# EasyEDA Pro project 毕业设计PCB板.eprj, board PCB1
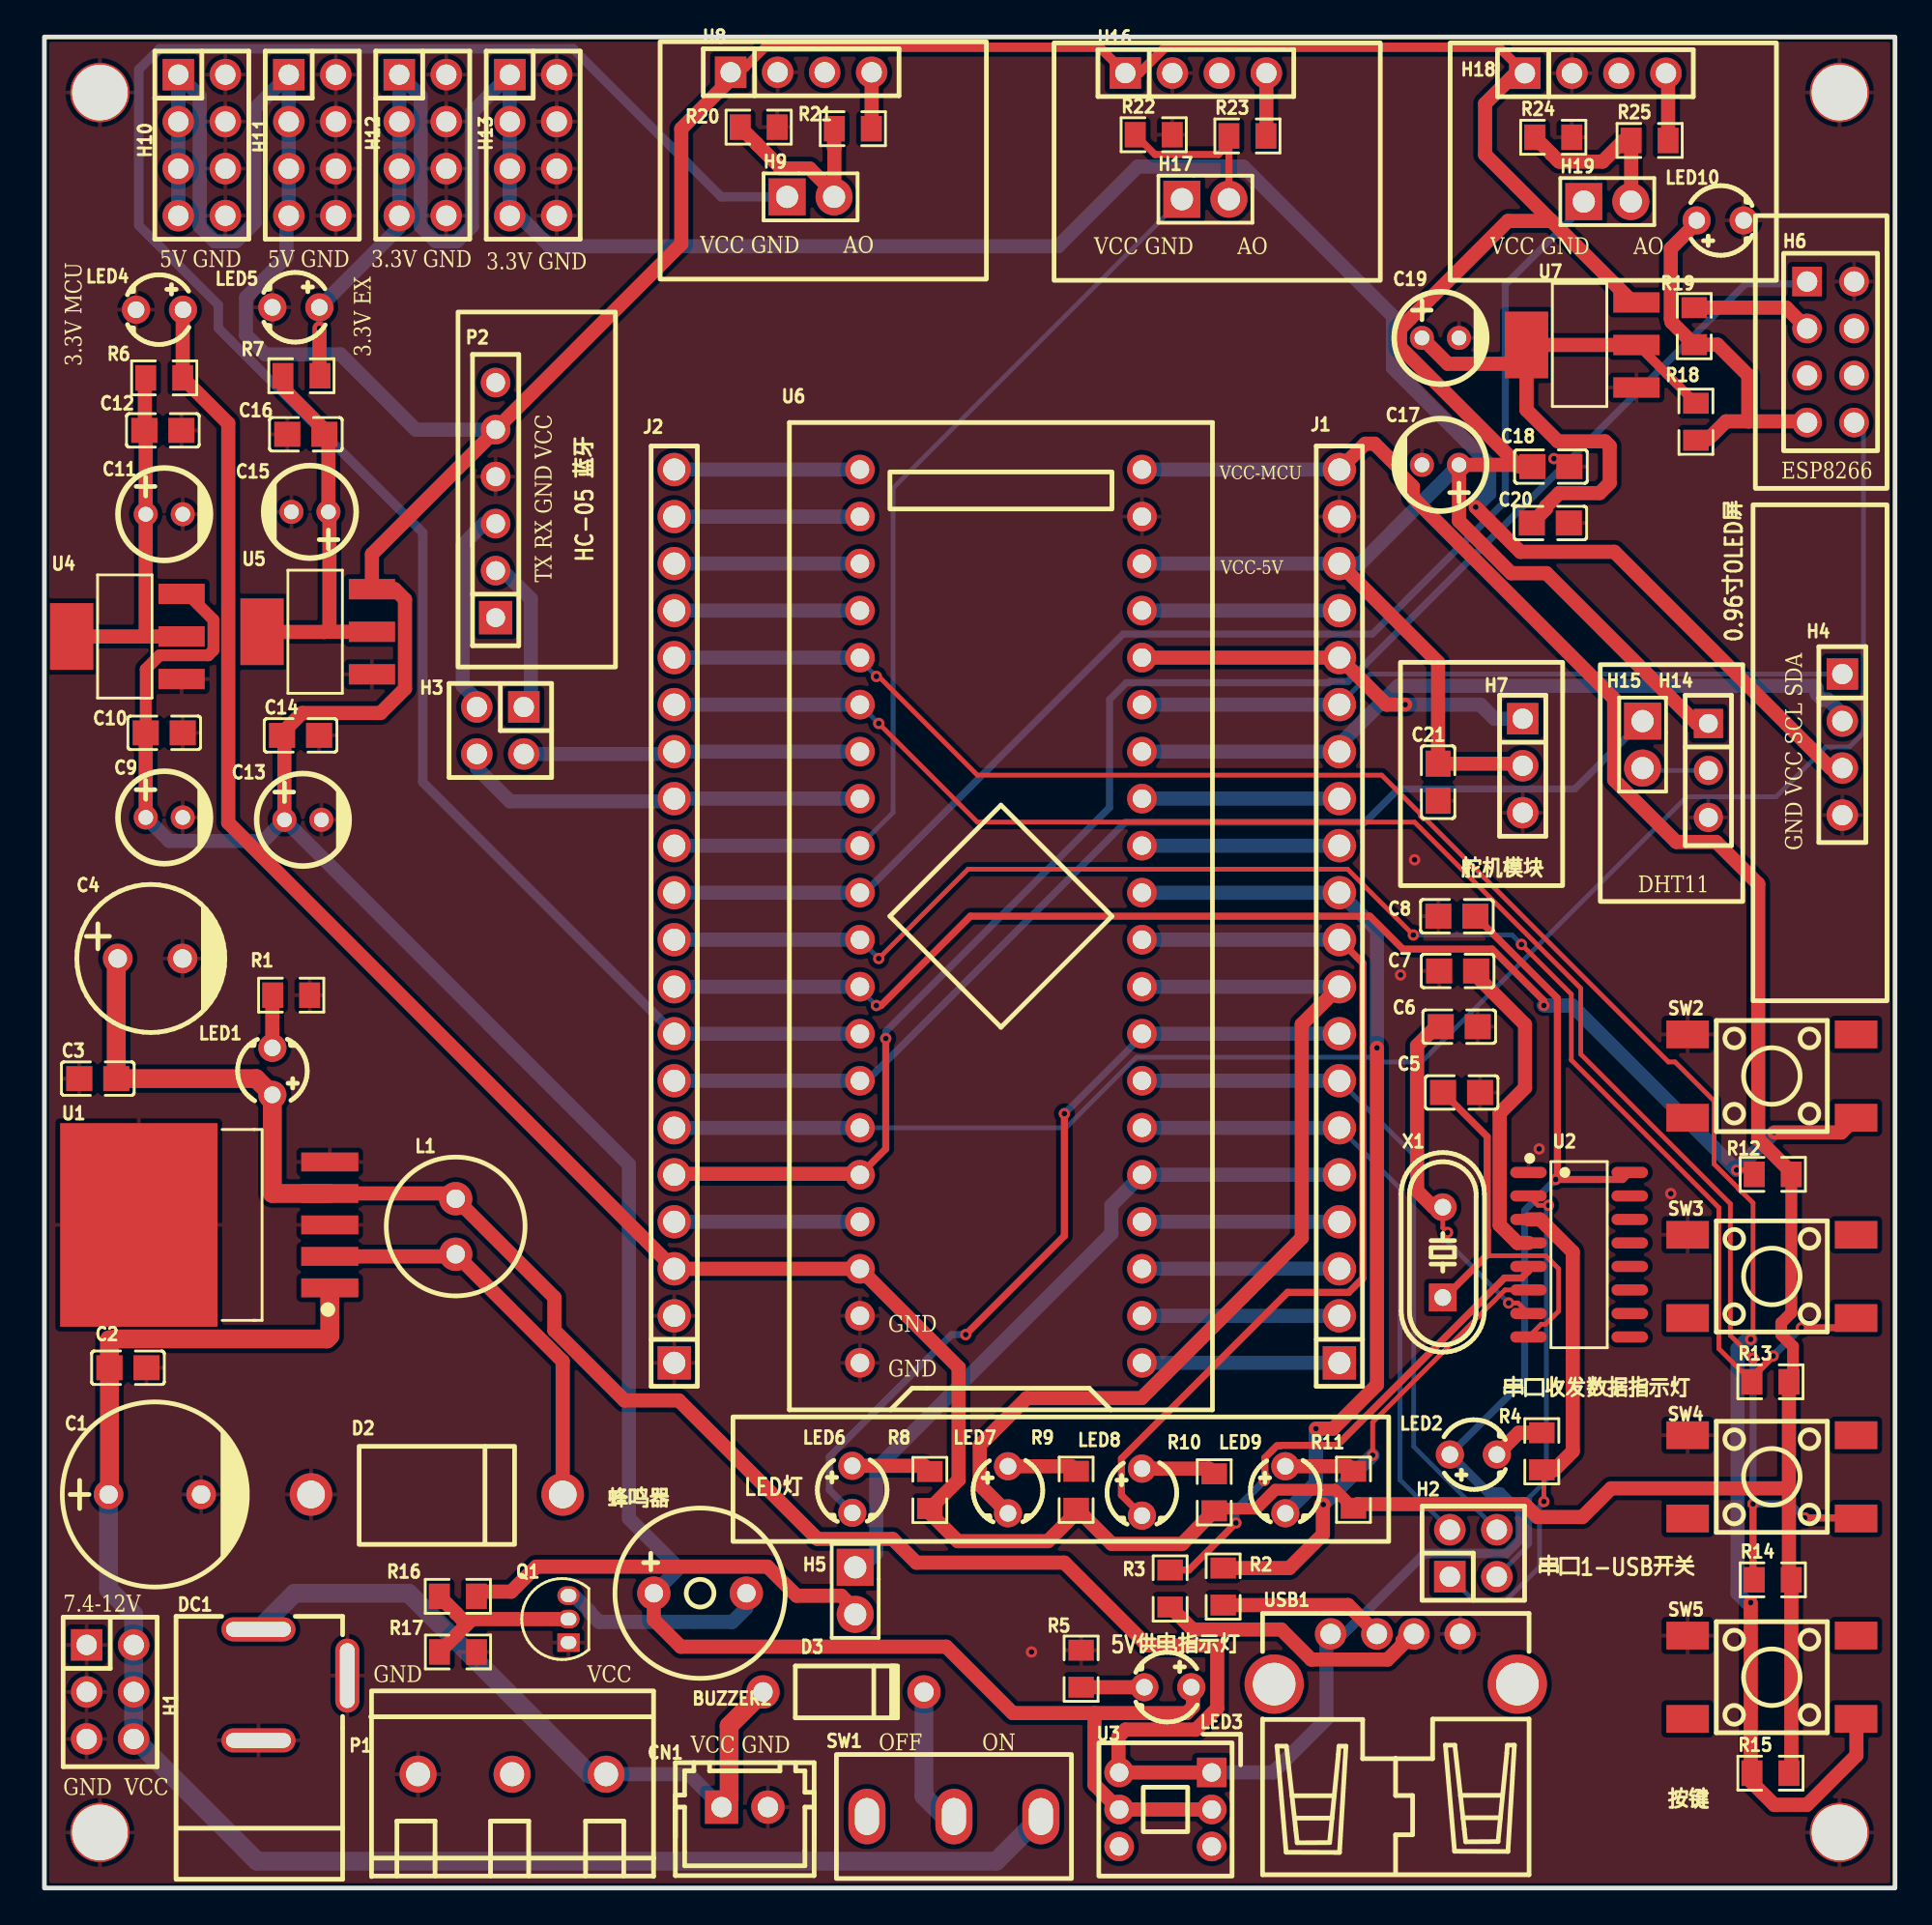
[diagram p1: board, top side]
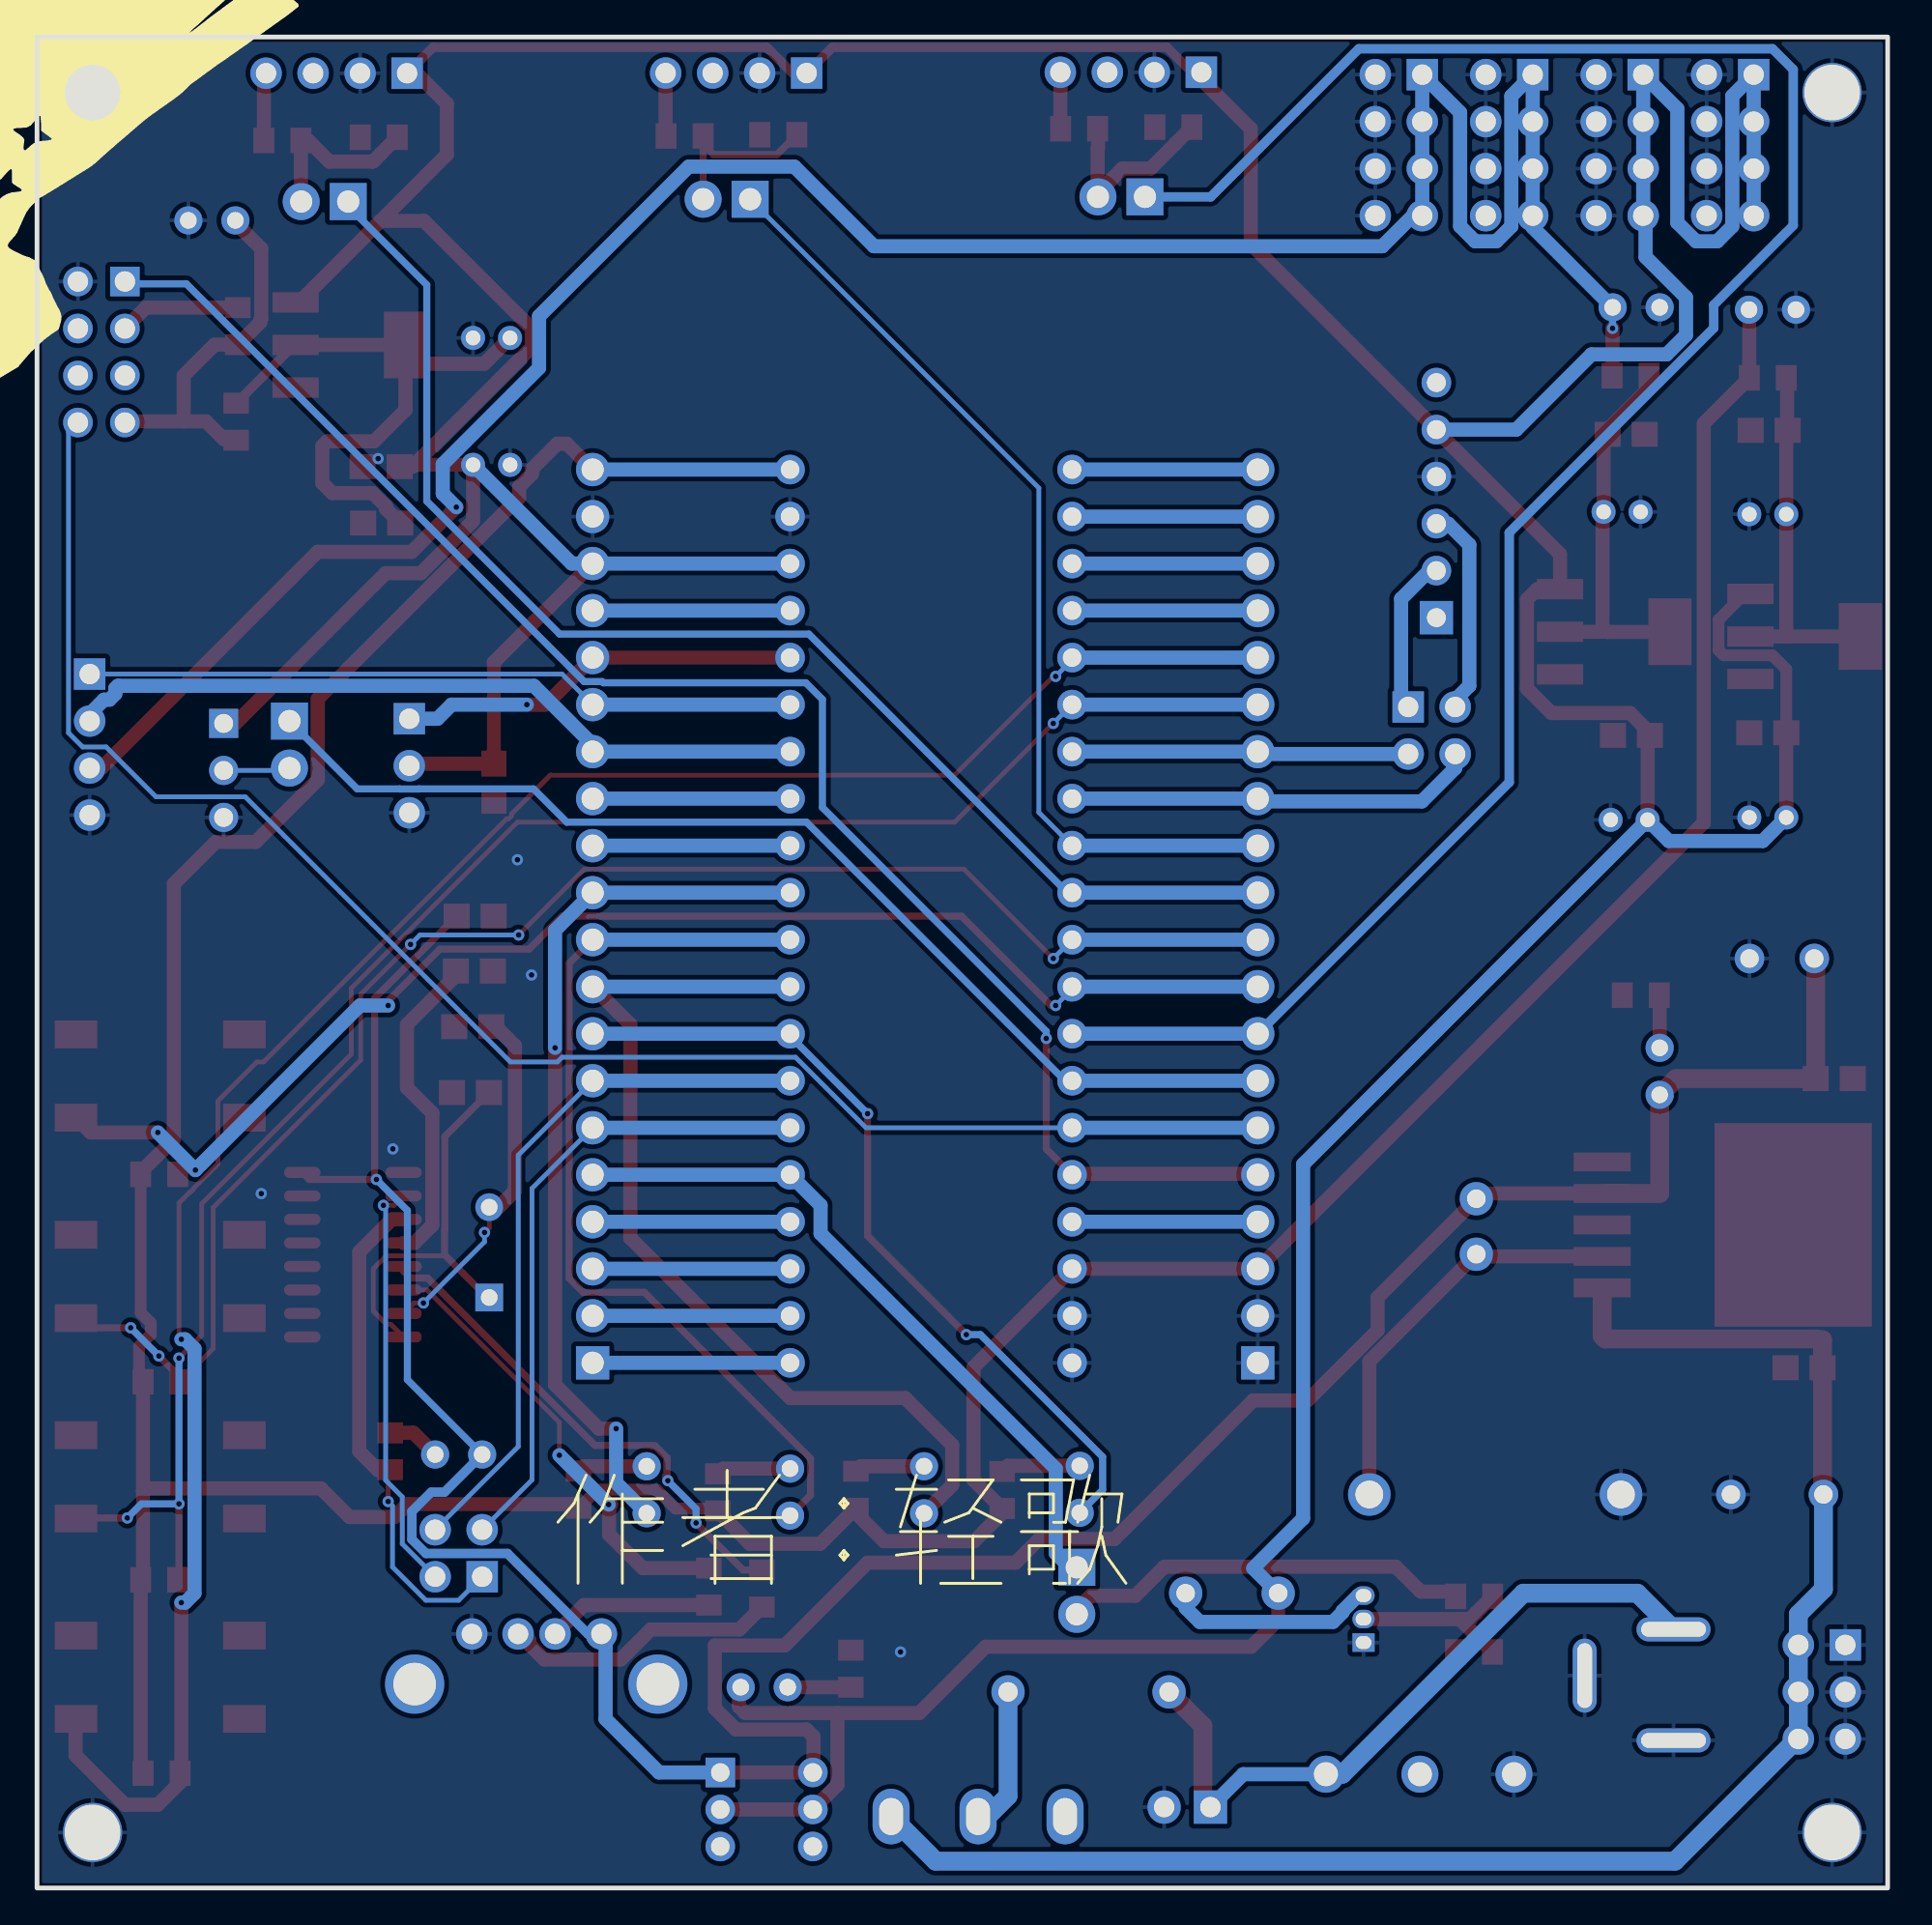
[diagram p2: board, bottom side, seen from below]

Outline 100 x 100 mm; copper layers: Top Layer, Bottom Layer. Coordinates in mm from the lower left corner of the outline.
Outline path: rectangle 0,100 100,0
Stack: Top Layer 0.035mm / Dielectric1 1.51mm FR4 er 4.5 / Bottom Layer 0.035mm

## Design rules (mm)
template: 自定义配置
spacing copperThickness1oz (default): track to track 0.102, other pairs 0.152 to 0.3
spacing copperThickness2oz: track to track 0.203, other pairs 0.152 to 0.3
track width copperThickness1oz (default): min 0.127, default 0.254, max 2.54
track width copperThickness2oz: min 0.203, default 0.254, max 2.54
track width 电源: min 0.254, default 0.381, max 2.54
differential pair differentialPair (default): width min 0.127, default 0.254, max 2.54; gap min 0.152, default 0.152
via viaSize (default): diameter min 0.5, default 0.61, max 10; hole min 0.3, default 0.305, max 6.299
net VCC-5V uses 电源
net +5V uses 电源
net VCC-EX uses 电源
net VCC-MCU uses 电源

## Placement (name value [footprint] x y rotation side)
BUZZER2  3kHz  [BUZ-TH_BD9.0-P5.00-D0.6-FD]  35.43 15.93 0 top
C1  680uF  [CAP-TH_BD10.0-P5.00-D0.6-FD]  5.97 21.26 0 top
C2  100nF  [C0805]  4.52 28.11 180 top
C3  100nF  [C0805]  2.89 43.73 0 top
C4  330uF  [CAP-TH_BD8.0-P3.50-D0.6-FD]  5.72 50.22 0 top
C5  22pF  [C0805]  76.58 42.98 0 top
C6  22pF  [C0805]  76.45 46.53 0 top
C7  100nF  [C0805]  76.37 49.54 0 top
C8  100nF  [C0805]  76.33 52.5 0 top
C9  10uF  [CAP-TH_BD5.0-P2.00-D0.8-FD]  6.48 57.84 0 top
C10  100nF  [C0805]  6.48 62.41 0 top
C11  10uF  [CAP-TH_BD5.0-P2.00-D0.8-FD]  6.48 74.22 0 top
C12  100nF  [C0805]  6.4 78.75 0 top
C13  10uF  [CAP-TH_BD5.0-P2.00-D0.8-FD]  13.97 57.71 0 top
C14  100nF  [C0805]  13.84 62.27 0 top
C15  10uF  [CAP-TH_BD5.0-P2.00-D0.8-FD]  14.35 74.35 180 top
C16  100nF  [C0805]  14.13 78.54 180 top
C17  10uF  [CAP-TH_BD5.0-P2.00-D0.8-FD]  75.44 76.89 180 top
C18  100nF  [C0805]  81.41 76.79 0 top
C19  10uF  [CAP-TH_BD5.0-P2.00-D0.8-FD]  75.44 83.74 0 top
C20  100nF  [C0805]  81.38 73.74 0 top
C21  100nF  [C0805]  75.31 59.74 270 top
CN1  HX25003-2A  [CONN-TH_2P-P2.50_HX25003-2A]  37.85 4.37 0 top
D2  1N5824  [DO-27_BD5.3-L8.4-P12.40-D1.3-RD]  21.21 21.26 180 top
D3  1N4007  [DO-41_BD2.4-L4.7-P8.70-D0.8-RD]  43.18 10.59 180 top
DC1  DC-005 2.0  [DC-IN-TH_DC-5520-1]  13.97 10.97 90 top
H1  PZ254-2-03-Z-8.5  [HDR-TH_6P-P2.54-V-M-R2-C3-S2.54]  3.56 10.59 270 top
H2  PZ254V-12-4P  [HDR-TH_4P-P2.54-V-M-R2-C2-S2.54]  77.22 18.09 0 top
H3  PZ254V-12-4P  [HDR-TH_4P-P2.54-V-M-R2-C2-S2.54]  24.64 62.53 180 top
H4  2.54-1*4P母  [HDR-TH_4P-P2.54-V-F]  97.16 61.77 270 top
H5  PZ254V-11-02P  [HDR-TH_2P-P2.54-V-M]  43.81 16.05 270 top
H6  PM254V-12-08-H85  [HDR-TH_8P-P2.54-V-F-R2-C4-S2.54]  96.52 82.98 270 top
H7  PZ254V-11-03P  [HDR-TH_3P-P2.54-V-M]  79.88 60.63 270 top
H8  2.54-1*4P母  [HDR-TH_4P-P2.54-V-F]  40.89 98.09 0 top
H9  PZ254V-11-02P  [HDR-TH_2P-P2.54-V-M]  41.4 91.36 0 top
H10  PZ254V-12-8P  [HDR-TH_8P-P2.54-V-M-R2-C4-S2.54]  8.51 94.16 270 top
H11  PZ254V-12-8P  [HDR-TH_8P-P2.54-V-M-R2-C4-S2.54]  14.48 94.16 270 top
H12  PZ254V-12-8P  [HDR-TH_8P-P2.54-V-M-R2-C4-S2.54]  20.45 94.16 270 top
H13  PZ254V-12-8P  [HDR-TH_8P-P2.54-V-M-R2-C4-S2.54]  26.42 94.16 270 top
H14  PM254V-11-03-H85  [HDR-TH_3P-P2.54-V-F]  89.92 60.38 270 top
H15  PZ254V-11-02P  [HDR-TH_2P-P2.54-V-M]  86.36 61.77 270 top
H16  2.54-1*4P母  [HDR-TH_4P-P2.54-V-F]  62.22 98.05 0 top
H17  PZ254V-11-02P  [HDR-TH_2P-P2.54-V-M]  62.74 91.24 0 top
H18  2.54-1*4P母  [HDR-TH_4P-P2.54-V-F]  83.81 98.04 0 top
H19  PZ254V-11-02P  [HDR-TH_2P-P2.54-V-M]  84.46 91.11 0 top
J1  2.54-1*20P直针  [HDR-TH_20P-P2.54-V-M-1]  69.98 52.5 90 top
J2  2.54-1*20P直针  [HDR-TH_20P-P2.54-V-M-1]  34.04 52.5 90 top
L1  33uH  [IND-TH_BD7.5-P3.00-D0.6]  22.22 35.74 90 top
LED1  XL-302SURD  [LED-TH_BD3.8-P2.54-RD]  12.32 44.12 270 top
LED2  XL-302SURD  [LED-TH_BD3.8-P2.54-RD]  77.22 23.42 180 top
LED3  XL-302SURD  [LED-TH_BD3.8-P2.54-RD]  60.71 10.85 0 top
LED4  XL-302SURD  [LED-TH_BD3.8-P2.54-RD]  6.22 85.27 0 top
LED5  XL-302SURD  [LED-TH_BD3.8-P2.54-RD]  13.59 85.39 0 top
LED6  XL-302SURD  [LED-TH_BD3.8-P2.54-RD]  43.66 21.54 90 top
LED7  XL-302SURD  [LED-TH_BD3.8-P2.54-RD]  52.07 21.51 90 top
LED8  XL-302SURD  [LED-TH_BD3.8-P2.54-RD]  59.31 21.39 90 top
LED9  XL-302SURD  [LED-TH_BD3.8-P2.54-RD]  67.06 21.51 90 top
LED10  XL-302SURD  [LED-TH_BD3.8-P2.54-RD]  90.55 90.09 180 top
NOREF  -  [Pad_e116]  3 97 0 top
NOREF#2  -  [Pad_e119]  97 3 0 top
NOREF#3  -  [Pad_e120]  3 3 0 top
NOREF#4  -  [Pad_e118]  97 97 0 top
P1  WJ500V-5.08-3P  [CONN-TH_3P-P5.00_WJ500V-5.08-3P]  25.27 6.15 0 top
P2  2.54-1*6P母  [HDR-TH_6P-P2.54-V-F]  24.38 74.98 90 top
Q1  S8050  [TO-92-3_L4.5-W3.5-P1.27-L]  28.32 14.53 90 top
R1  10kΩ  [R0805]  13.34 48.23 0 top
R2  27Ω  [R0805]  63.7 16.28 270 top
R3  27Ω  [R0805]  60.83 16.18 270 top
R4  1kΩ  [R0805]  80.91 23.59 270 top
R5  10kΩ  [R0805]  56.02 11.85 90 top
R6  1kΩ  [R0805]  6.48 81.58 0 top
R7  1kΩ  [R0805]  13.89 81.7 0 top
R8  1kΩ  [R0805]  47.85 21.5 90 top
R9  1kΩ  [R0805]  55.75 21.51 90 top
R10  1kΩ  [R0805]  63.21 21.38 90 top
R11  1kΩ  [R0805]  70.74 21.51 90 top
R12  10kΩ  [R0805]  93.4 38.56 0 top
R13  10kΩ  [R0805]  93.27 27.35 0 top
R14  10kΩ  [R0805]  93.4 16.65 0 top
R15  10kΩ  [R0805]  93.27 6.2 0 top
R16  1kΩ  [R0805]  22.34 15.76 0 top
R17  10kΩ  [R0805]  22.35 12.75 0 top
R18  1kΩ  [R0805]  89.24 79.22 270 top
R19  10kΩ  [R0805]  89.15 84.38 90 top
R20  10kΩ  [R0805]  38.6 95.13 0 top
R21  4.7kΩ  [R0805]  43.69 95.05 0 top
R22  10kΩ  [R0805]  59.94 94.72 0 top
R23  4.7kΩ  [R0805]  65.01 94.66 0 top
R24  10kΩ  [R0805]  81.53 94.58 0 top
R25  4.7kΩ  [R0805]  86.74 94.41 0 top
SW1  SS-12D10L5  [SW-TH_SS-12D10L5]  49.15 3.86 0 top
SW2  KH-6X6X5H-STM  [SW-SMD_4P-L6.0-W6.0-P4.50-LS9.0-2]  93.34 43.87 0 top
SW3  KH-6X6X5H-STM  [SW-SMD_4P-L6.0-W6.0-P4.50-LS9.0-2]  93.34 33.04 0 top
SW4  KH-6X6X5H-STM  [SW-SMD_4P-L6.0-W6.0-P4.50-LS9.0-2]  93.34 22.21 0 top
SW5  KH-6X6X5H-STM  [SW-SMD_4P-L6.0-W6.0-P4.50-LS9.0-2]  93.34 11.39 0 top
U1  LM2596S-5.0  [TO-263-5_L10.2-W8.9-P1.70-BR]  10.26 35.82 0 top
U2  CH340G  [SOIC-16_L9.9-W3.9-P1.27-LS6.0-BL]  82.93 34.21 270 top
U3  PS-7054DVB-6PL  [SW-TH_6P-L7.0-W7.0-P2.00]  60.58 4.24 0 top
U4  LM1117S-3.3  [SOT-223-3_L6.5-W3.4-P2.30-LS7.0-BR]  4.44 67.61 0 top
U5  LM1117S-3.3  [SOT-223-3_L6.5-W3.4-P2.30-LS7.0-BR]  14.73 67.87 0 top
U6  STM32F103C8T6  [CONN-TH_L53.3-W22.9_STM32F103C8T6-CARD]  51.69 52.5 90 top
U7  LM1117S-3.3  [SOT-223-3_L6.5-W3.4-P2.30-LS7.0-BR]  83.06 83.36 0 top
USB1  AF 90° WJDG  [USB-A-TH_AF-WJDG]  73.03 12.37 0 top
X1  12MHz  [HC-49US_L11.5-W4.5-P4.88]  75.56 34.34 90 top

## Footprints (pads in the part's own frame, mm; a bottom-side part is the same pattern mirrored in y, then rotated)
BUZ-TH_BD9.0-P5.00-D0.6-FD
  round 1.8 hole 1: 1(-2.5,0) 2(2.5,0)
C0805
  rect 1.41x1.35 smd: 1(-1,0) 2(1,0)
CAP-TH_BD5.0-P2.00-D0.8-FD
  round 1.3 hole 0.8: 1(-1,0) 2(1,0)
CAP-TH_BD8.0-P3.50-D0.6-FD
  round 1.6 hole 1: 1(-1.75,0) 2(1.75,0)
CAP-TH_BD10.0-P5.00-D0.6-FD
  round 1.6 hole 1: 1(-2.5,0) 2(2.5,0)
CONN-TH_2P-P2.50_HX25003-2A
  rect 1.8x1.8 hole 1.1: 1(-1.25,0)
  round 1.8 hole 1.1: 2(1.25,0)
CONN-TH_3P-P5.00_WJ500V-5.08-3P
  round 2 hole 1.3: 1(-5.08,0) 2(0,0) 3(5.08,0)
CONN-TH_L53.3-W22.9_STM32F103C8T6-CARD
  round 1.6 hole 1: 1(-24.13,-7.62) 2(-21.59,-7.62) 3(-19.05,-7.62) 4(-16.51,-7.62) 5(-13.97,-7.62) 6(-11.43,-7.62) 7(-8.89,-7.62) 8(-6.35,-7.62) 9(-3.81,-7.62) 10(-1.27,-7.62) 11(1.27,-7.62) 12(3.81,-7.62) 13(6.35,-7.62) 14(8.89,-7.62) 15(11.43,-7.62) 16(13.97,-7.62) 17(16.51,-7.62) 18(19.05,-7.62) 19(21.59,-7.62) 20(24.13,-7.62) 21(24.13,7.62) 22(21.59,7.62) 23(19.05,7.62) 24(16.51,7.62) 25(13.97,7.62) 26(11.43,7.62) 27(8.89,7.62) 28(6.35,7.62) 29(3.81,7.62) 30(1.27,7.62) 31(-1.27,7.62) 32(-3.81,7.62) 33(-6.35,7.62) 34(-8.89,7.62) 35(-11.43,7.62) 36(-13.97,7.62) 37(-16.51,7.62) 38(-19.05,7.62) 39(-21.59,7.62) 40(-24.13,7.62)
DC-IN-TH_DC-5520-1
  oval 4x1.3 hole 3.5x0.8: 2(0.5,-2.4)
  oval 1.3x4 hole 0.8x3.5: 3(-3,2.4) 4(3,2.4)
DO-27_BD5.3-L8.4-P12.40-D1.3-RD
  round 2.3 hole 1.5: 1(-6.8,0) 2(6.8,0)
DO-41_BD2.4-L4.7-P8.70-D0.8-RD
  round 1.8 hole 1.05: 1(-4.35,0) 2(4.35,0)
HC-49US_L11.5-W4.5-P4.88
  rect 1.5x1.5 hole 0.9: 1(-2.44,0)
  round 1.5 hole 0.9: 2(2.44,0)
HDR-TH_2P-P2.54-V-M
  rect 2x2 hole 1.2: 1(-1.27,0)
  round 2 hole 1.2: 2(1.27,0)
HDR-TH_3P-P2.54-V-F
  rect 1.575x1.575 hole 1.02: 1(-2.54,0)
  round 1.575 hole 1.02: 2(0,0) 3(2.54,0)
HDR-TH_3P-P2.54-V-M
  rect 1.7x1.7 hole 1.1: 1(-2.54,0)
  round 1.7 hole 1.1: 2(0,0) 3(2.54,0)
HDR-TH_4P-P2.54-V-F
  rect 1.7x1.7 hole 1.1: 1(-3.81,0)
  round 1.7 hole 1.1: 2(-1.27,0) 3(1.27,0) 4(3.81,0)
HDR-TH_4P-P2.54-V-M-R2-C2-S2.54
  rect 1.7x1.7 hole 1.1: 1(-1.27,-1.27)
  round 1.7 hole 1.1: 2(-1.27,1.27) 3(1.27,-1.27) 4(1.27,1.27)
HDR-TH_6P-P2.54-V-F
  rect 1.8x1.8 hole 1.02: 1(-6.35,0)
  round 1.6 hole 1.02: 2(-3.81,0) 3(-1.27,0) 4(1.27,0) 5(3.81,0) 6(6.35,0)
HDR-TH_6P-P2.54-V-M-R2-C3-S2.54
  rect 1.7x1.7 hole 1.1: 1(-2.54,-1.27)
  round 1.7 hole 1.1: 2(-2.54,1.27) 3(0,-1.27) 4(0,1.27) 5(2.54,-1.27) 6(2.54,1.27)
HDR-TH_8P-P2.54-V-F-R2-C4-S2.54
  rect 1.6x1.6 hole 1.1: 1(-3.81,-1.27)
  round 1.6 hole 1.1: 2(-3.81,1.27) 3(-1.27,-1.27) 4(-1.27,1.27) 5(1.27,-1.27) 6(1.27,1.27) 7(3.81,-1.27) 8(3.81,1.27)
HDR-TH_8P-P2.54-V-M-R2-C4-S2.54
  rect 1.7x1.7 hole 1.1: 1(-3.81,-1.27)
  round 1.7 hole 1.1: 2(-3.81,1.27) 3(-1.27,-1.27) 4(-1.27,1.27) 5(1.27,-1.27) 6(1.27,1.27) 7(3.81,-1.27) 8(3.81,1.27)
HDR-TH_20P-P2.54-V-M-1
  rect 1.8x1.8 hole 1.2: 1(-24.13,0)
  round 1.8 hole 1.2: 2(-21.59,0) 3(-19.05,0) 4(-16.51,0) 5(-13.97,0) 6(-11.43,0) 7(-8.89,0) 8(-6.35,0) 9(-3.81,0) 10(-1.27,0) 11(1.27,0) 12(3.81,0) 13(6.35,0) 14(8.89,0) 15(11.43,0) 16(13.97,0) 17(16.51,0) 18(19.05,0) 19(21.59,0) 20(24.13,0)
IND-TH_BD7.5-P3.00-D0.6
  round 1.8 hole 1: 1(-1.5,0) 2(1.5,0)
LED-TH_BD3.8-P2.54-RD
  round 1.524 hole 0.9: 1(-1.27,0) 2(1.27,0)
Pad_e116
  round 3.2 hole 3: 0(0,0)
Pad_e118
  round 3.2 hole 3: 1(0,0)
Pad_e119
  round 3.2 hole 3: 2(0,0)
Pad_e120
  round 3.2 hole 3: 3(0,0)
R0805
  rect 1.133x1.377 smd: 1(-1,0) 2(1,0)
SOIC-16_L9.9-W3.9-P1.27-LS6.0-BL
  oval 0.602x1.971 smd: 1(-4.445,-2.736) 2(-3.175,-2.736) 3(-1.905,-2.736) 4(-0.635,-2.736) 5(0.635,-2.736) 6(1.905,-2.736) 7(3.175,-2.736) 8(4.445,-2.736) 9(4.445,2.736) 10(3.175,2.736) 11(1.905,2.736) 12(0.635,2.736) 13(-0.635,2.736) 14(-1.905,2.736) 15(-3.175,2.736) 16(-4.445,2.736)
SOT-223-3_L6.5-W3.4-P2.30-LS7.0-BR
  rect 2.5x1.1 smd: 1(2.97,-2.3) 2(2.97,0) 3(2.97,2.3)
  rect 2.34x3.6 smd: 4(-2.97,0)
SW-SMD_4P-L6.0-W6.0-P4.50-LS9.0-2
  rect 2.3x1.5 smd: 1(-4.55,2.25) 2(4.55,2.25) 3(-4.55,-2.25) 4(4.55,-2.25)
SW-TH_6P-L7.0-W7.0-P2.00
  rect 1.6x1.6 hole 1: 1(2.499,2)
  round 1.6 hole 1: 2(2.5,0) 3(2.5,-2) 4(-2.5,2) 5(-2.5,0) 6(-2.5,-2)
SW-TH_SS-12D10L5
  oval 2x3 hole 1.3x2: 1(-4.7,0) 2(0,0) 3(4.7,0)
TO-92-3_L4.5-W3.5-P1.27-L
  rect 1x1.2 hole 0.7x0.85: 1(-1.27,0)
  oval 1x1.2 hole 0.7x0.85: 2(0,0) 3(1.27,0)
TO-263-5_L10.2-W8.9-P1.70-BR
  rect 3.083x1.02 smd: 1(5.16,-3.4) 2(5.16,-1.7) 3(5.16,0) 4(5.16,1.7) 5(5.16,3.4)
  rect 8.5x11 smd: 6(-5.16,0)
USB-A-TH_AF-WJDG
  round 1.7 hole 1.1: 1(-3.521,1.355) 2(-1.018,1.355) 3(0.981,1.355) 4(3.48,1.355)
  round 3.2 hole 2.3: 5(-6.57,-1.355) 5(6.57,-1.355)

## Nets
As in the schematic, except:
GND: C1.2 C2.1 C3.1 C4.2 C5.2 C6.2 C7.1 C8.1 C9.2 C10.2 C11.2 C12.2 C13.2 C14.2 C15.2 C16.2 C17.2 C18.2 C19.2 C20.2 C21.2 CN1.2 D2.2 DC1.2 DC1.3 H1.1 H1.3 H1.5 H4.4 H6.2 H7.3 H8.2 H10.2 H10.4 H10.6 H10.8 H11.2 H11.4 H11.6 H11.8 H12.2 H12.4 H12.6 H12.8 H13.2 H13.4 H13.6 H13.8 H14.3 H16.2 H18.2 J1.19 J2.1 J2.2 LED4.1 LED5.1 LED10.1 NOREF.0 NOREF#2.2 NOREF#3.3 NOREF#4.1 P1.1 P2.4 Q1.1 R1.2 R5.2 R17.2 R20.2 R22.2 R24.2 SW2.1 SW3.1 SW4.1 SW5.1 U1.3 U1.5 U1.6 U2.1 U4.1 U5.1 U6.19 U6.39 U6.40 U7.1 USB1.4

Pads without a net: H6 4 5 6; H8 3; H16 3; H18 3; P1 2; P2 1 6; SW1 1; SW2 2 3; SW3 2 3; SW4 2 3; SW5 2 3; U2 9 10 11 12 13 14 15; U3 3 6; USB1 5

## Via types
v1: diameter 0.61, hole 0.305, Top Layer to Bottom Layer, 39 vias

## Routing (per net, layer and track width the routed paths; a pad name or vN(x,y) marks a point on that pad's centre or on a via; arc(x,y) is an arc through that point)
+5V: length 167.6
  Top Layer w0.381: 85.67,38.66 85.29,38.28 81.76,38.28 ; 81.76,38.28 81.76,48.07 C8.2 ; 81.76,38.28 v1(81.66,38.28)
  Top Layer w0.762: U3.1 U3.4 58.04,6.28 58.04,8.18 58.42,8.56 62.23,8.56 63.37,9.7 63.37,13.1 59.59,13.1 55.12,17.58 47.12,17.58 45.84,18.86 41.77,18.86 34.29,26.34 31.34,26.34 27.56,30.13 27.56,31.9 L1.2 21.94,37.52 U1.4
  Top Layer w1.016: U1.4 12.32,37.52 LED1.2 11.44,43.73 C3.2 3.89,50.14 C4.1
  Bottom Layer w0.381: v1(81.66,38.28) 79.99,36.6 79.99,27.46 LED2.2
  Bottom Layer w0.508: USB1.1 70.23,13.72 74.58,18.07 78.98,18.07 79.74,18.83 79.74,20.34 78.7,21.39 77.98,21.39 LED2.2
  Bottom Layer w0.762: USB1.1 69.28,13.5 69.28,9.13 66.39,6.24 U3.1
GND:
  vias: v1(53.34,12.75) v1(73.28,49.33) v1(74.04,55.55) v1(80.77,39.93) v1(81.57,77.22) v1(87.88,37.52)
VCC-5V: length 379.9
  Top Layer w0.508: H8.1 37.34,98.35 37.85,98.35 38.94,99.45 57.02,99.45 H16.1 59.17,98.05 60.57,99.45 78.6,99.45 H18.1
  Top Layer w0.635: 7.42,69.92 7.73,69.92 9.14,68.51 9.14,66.87 8.86,66.59 6.23,66.59 5.48,65.84 C10.1
  Top Layer w0.762: J1.18 75.31,66.22 C21.1 79.77,60.74 H7.2 ; 79.62,76.89 73.25,83.25 73.25,84.23 79.08,90.06 81.44,90.06 ; 79.62,76.89 79.72,76.79 C18.1 ; 79.62,76.89 C17.1 76.44,73.85 79.26,71.03 81.16,71.03 89.28,62.92 H14.1 ; BUZZER2.1 32.93,14.49 34.39,13.04 48.74,13.04 52.32,9.45 56.75,9.45 ; U7.3 85.84,85.66 81.44,90.06 ; 81.44,90.06 77.85,93.65 77.85,96.4 79.5,98.04 H18.1 ; 56.75,9.45 61.72,9.45 62.07,9.8 62.07,10.94 ; 56.75,9.45 56.75,5.58 U3.5 U3.2 ; C9.1 C10.1 ; H8.1 37.08,97.71 34.42,95.05 34.42,88.82 P2.5 24.38,78.74 17.7,72.06 U5.3 18.93,70.17 19.49,69.62 19.49,64.8 18.17,63.48 13.92,63.48 12.84,62.4 C14.1 12.97,62.14 C13.1
  Bottom Layer w0.762: C9.1 6.75,56.57 11.83,56.57 C13.1 31.59,39.09 31.59,19.97 34.28,17.27 BUZZER2.1 ; H10.7 H10.5 H10.3 H10.1 8.4,96.81 8.4,89.78 9.21,88.96 10.35,88.96 11.36,89.98 11.36,96.12 H11.1 H11.3 H11.5 H11.7 13.08,90.22 13.08,88.12 10.9,85.93 10.9,83.9 11.94,82.86 16,82.86 20.07,78.79 P2.5 ; U6.18 J1.18 71.1,71.55 C17.1
VCC-EX: length 138.8
  Top Layer w0.762: H4.3 96.52,60.5 84.84,72.19 79.76,72.19 v1(77.34,74.6) ; v1(14.87,84.26) 14.87,81.72 R7.2
  Bottom Layer w0.381: 14.87,85.4 v1(14.87,84.26)
  Bottom Layer w0.762: LED5.2 19.18,89.71 H12.7 H12.5 H12.3 H12.1 20.33,96.81 20.33,89.78 21.14,88.96 22.29,88.96 23.1,89.78 23.1,95.92 H13.1 H13.3 H13.5 H13.7 25.65,90.35 27.31,88.7 54.77,88.7 59.07,93 64.79,93 72.87,84.91 72.87,82.13 78.08,76.92 78.08,75.33 v1(77.34,74.6)
VCC-MCU: length 236.7
  Top Layer w0.635: R11.1 69.74,21.51 66.52,21.51 65.5,20.49 63.33,20.49 R10.1 ; R12.2 94.4,31.08 93.85,30.53 93.85,29.9 94.49,29.26 94.49,27.56 R13.2
  Top Layer w0.762: R12.2 94.4,38.67 92.61,40.46 92.61,54.25 90.34,56.52 88.18,56.52 84.83,59.87 84.83,64.24 73.95,75.12 73.95,75.7 73.25,76.4 73.25,76.66 71.88,78.03 71.37,78.03 J1.20 ; R13.2 94.27,21.46 ; 94.27,21.46 94.27,16.78 R14.2 94.4,6.33 R15.2 ; 94.27,21.46 94.14,21.59 84.66,21.59 83.11,20.04 80.68,20.04 79.98,20.74 70.96,20.74 R11.1 ; LED4.2 7.48,85.25 R6.2 9.94,79.13 9.94,57.55 J2.3 U6.38 49.4,28.12 49.4,22.05 47.86,20.5 R8.1 47.85,20.25 49.36,18.74 54.23,18.74 55.75,20.26 R9.1 57.67,18.59 61.48,18.59 R10.1 63.27,20.38
  Bottom Layer w0.762: J1.20 U6.20
ADC12_IN4: length 52.2
  Bottom Layer w0.254: H17.1 45.87,75.63 45.87,58.11 U6.29
  Bottom Layer w0.762: J2.12 U6.29
ADC12_IN5: length 71.6
  Bottom Layer w0.381: H19.1 83.19,90.86 78.94,86.61 78.94,74.93 71.75,67.74 58.29,67.74 44.32,53.77
  Bottom Layer w0.762: J2.11 44.32,53.77
ADC12_IN8: length 112.9
  Bottom Layer w0.508: H9.1 36.58,91.36 28.57,99.37 6.22,99.37 5.1,98.24 5.1,89.82 9.4,85.52 9.4,84.27 20.45,73.22 20.45,59.74 J2.8
  Bottom Layer w0.762: J2.8 U6.33
BEEP: length 38.5
  Bottom Layer w0.762: H5.1 44.19,17.32 44.95,18.09 44.95,22.65 57.66,35.36 57.66,36.88 U6.5 J1.5
D1: length 44.4
  Top Layer w0.381: v1(49.78,29.9) 55.12,35.23 v1(55.12,41.83)
  Bottom Layer w0.381: 59.44,46.15 v1(55.12,41.83) ; LED6.1 42.42,21.51 42.42,23.29 49.02,29.9 v1(49.78,29.9)
  Bottom Layer w0.762: J1.8 59.44,46.15
D2: length 51.4
  Top Layer w0.762: J1.9 67.94,46.66 67.94,35.12 59.29,26.47 53.09,26.47 50.55,23.93 50.55,21.77 LED7.1
  Bottom Layer w0.762: J1.9 U6.9
D3: length 50.1
  Top Layer w0.381: LED8.1 58.2,21.22 58.2,23.2 67.18,32.18 70.49,32.18 71.25,32.94 71.25,49.96 J1.10
  Bottom Layer w0.762: J1.10 U6.10
D4: length 47.6
  Top Layer w0.762: v1(72.01,45.39) 72.01,27.19 69.64,24.82 v1(68.71,24.82)
  Bottom Layer w0.762: v1(68.71,24.82) 68.71,21.9 LED9.1 ; v1(72.01,45.39) 72.01,51.74 J1.11 U6.11
D+: length 27.5
  Top Layer w0.381: R3.1 61.85,17.18 v1(64.39,19.72) ; U2.5 80.2,33.33 79.82,32.95 78.89,32.95 69.85,23.91 66.8,23.91 66.78,23.89 66.6,23.89 65.95,23.24 65.95,22.33 66.04,22.24 66.04,22.13 v1(65.91,22.01)
  Bottom Layer w0.381: v1(64.39,19.72) 64.39,20.48 v1(65.91,22.01)
D-: length 24.8
  Top Layer w0.254: U2.6 78.93,32.31 71.77,25.16 v1(71.77,23.38)
  Top Layer w0.762: 68.98,20.71 v1(69.11,20.71) 69.09,20.69 69.09,19.1 67.27,17.28 R2.1
  Bottom Layer w0.762: v1(69.11,20.71) v1(71.77,23.38)
DHT11: length 60.4
  Bottom Layer w0.381: 86.36,63.04 82.69,59.38 80.41,59.38 80.4,59.37 79.36,59.37 79.36,59.38 73.17,59.38 71.37,57.58 58.42,57.58 44.45,43.61 U6.34
  Bottom Layer w0.762: J2.7 U6.34
I2C1_SCL: length 40.7
  Bottom Layer w0.762: 97.16,63.04 97.16,63.42 96.38,64.2 96.08,64.2 95.77,64.51 95.77,64.81 95.63,64.95 73.15,64.95 69.98,61.77 J1.14 U6.14
I2C1_SDA: length 38.5
  Bottom Layer w0.254: J1.15 71.63,65.58 H4.1
  Bottom Layer w0.762: J1.15 U6.15
KEY1: length 74.3
  Top Layer w0.254: R12.1 92.17,38.79 v1(91.44,38.79)
  Top Layer w0.381: v1(81.03,47.68) 81.03,47.93 78.23,50.72 73.41,50.72 71.63,52.5 50.04,52.5 45.21,47.68 v1(44.96,47.68)
  Top Layer w0.762: SW2.4 97.1,40.82 v1(93.47,40.82)
  Bottom Layer w0.254: 43.94,48.69 v1(44.96,47.68)
  Bottom Layer w0.762: v1(93.47,40.82) v1(91.44,38.79) 82.55,47.68 v1(81.03,47.68) ; J2.9 43.94,48.69
KEY2: length 85.8
  Top Layer w0.254: v1(73.97,51.49) 70.42,55.04 49.91,55.04 v1(45.09,50.22) ; v1(79.82,50.98) 82.51,48.28 82.51,44.73 90.48,36.75 90.48,29.13 R13.1
  Top Layer w0.381: 92.15,27.47 v1(93.42,28.74) ; v1(94.94,30.27) 97.37,30.27 SW3.4
  Bottom Layer w0.254: U6.31 v1(45.09,50.22) ; v1(79.82,50.98) 79.31,51.49 v1(73.97,51.49)
  Bottom Layer w0.381: v1(93.42,28.74) v1(94.94,30.27)
  Bottom Layer w0.762: J2.10 U6.31
KEY3: length 97.1
  Top Layer w0.254: v1(45.09,62.92) 50.42,57.58 74.04,57.58 83.02,48.6 83.02,45.05 91.1,36.96 91.1,29.85 v1(92.33,28.63)
  Top Layer w0.381: v1(92.33,20.75) 92.33,16.72 R14.1 ; v1(95.12,19.99) 97.87,19.99 SW4.4
  Bottom Layer w0.254: U6.26 v1(45.09,62.92)
  Bottom Layer w0.381: v1(95.12,19.99) 94.36,20.75 v1(92.33,20.75) v1(92.33,28.63)
  Bottom Layer w0.762: J2.15 U6.26
KEY4: length 114
  Top Layer w0.254: v1(92.2,29.64) 92.33,29.77 92.33,37.01 91.75,37.59 91.72,37.59 91.55,37.75 91.55,37.78 90.22,39.11 90.22,42.52 88.12,44.63 87.76,44.63 74.63,57.76 74.52,57.76 74.36,57.92 74.36,58.03 72.26,60.12 50.42,60.12 45.09,65.46 v1(44.96,65.46)
  Top Layer w0.762: SW5.4 97.92,9.11 97.92,7.16 95.25,4.5 93.47,4.5 92.27,5.7 R15.1 92.2,6.27 v1(92.2,15.42)
  Bottom Layer w0.254: 43.94,66.47 v1(44.96,65.46)
  Bottom Layer w0.762: v1(92.2,29.64) 92,29.64 91.49,29.13 91.49,15.93 92,15.42 v1(92.2,15.42) ; J2.16 43.94,66.47
PA2: length 18.2
  Bottom Layer w0.762: U6.27 J2.14 33.91,61.27 H3.2
PA3: length 22.3
  Bottom Layer w0.762: H3.4 23.37,60.5 25.16,58.71 33.89,58.71 J2.13 U6.28
PA9: length 34.9
  Bottom Layer w0.254: H2.2 73.25,22.05 73.25,37.8 J1.6
  Bottom Layer w0.762: J1.6 U6.6
PA10: length 38.4
  Bottom Layer w0.254: J1.7 74,39.59 74,23.84 H2.4
  Bottom Layer w0.762: J1.7 U6.7
SG1: length 21.9
  Top Layer w0.762: v1(73.53,63.93) 72.52,63.93 J1.16 U6.16
  Bottom Layer w0.762: v1(73.53,63.93) 77.6,63.93 78.36,63.17 H7.1
UART1_RX: length 22.5
  Top Layer w0.254: U2.2 80.7,36.88 v1(81.28,36.88)
  Bottom Layer w0.254: v1(81.28,36.88) 81.16,36.76 81.16,22.03 80.26,21.13 80.26,18.59 H2.3
UART1_TX: length 27.5
  Top Layer w0.254: v1(81.03,20.88) 81.03,22.48 R4.2
  Top Layer w0.762: 80.94,22.57 81.57,22.57 82.59,23.59 82.59,34.36 80.83,36.12 U2.3
  Bottom Layer w0.254: v1(81.03,20.88) 80.79,20.64 80.79,17.34 78.99,15.54 77.22,15.54 H2.1
UART2_RX: length 11.3
  Bottom Layer w0.762: H3.3 23.37,64.19 22.61,64.95 22.61,72.57 23.75,73.71 P2.3
UART2_TX: length 8.5
  Bottom Layer w0.762: H3.1 26.29,64.19 26.29,69.65 24.77,71.17 24.38,71.17
UART3_RX: length 88.4
  Top Layer w0.254: 44.12,38.58 U6.36
  Top Layer w0.381: 44.12,38.58 45.47,39.93 v1(45.47,45.9)
  Top Layer w0.762: J2.5 34.09,38.58 44.12,38.58
  Bottom Layer w0.381: H6.1 95.12,86.67 91.93,86.67 70.44,65.17 69.46,65.17 69.4,65.11 58.46,65.11 57.56,64.21 57.56,58.37 45.47,46.28 v1(45.47,45.9)
UART3_TX: length 90.3
  Bottom Layer w0.254: H6.8 98.3,78.66 98.3,62.41 97.54,61.65 96.27,61.65 93.57,58.95 88.75,58.95 74.42,44.63 71.88,44.63 71.63,44.88 59.01,44.88 55.2,41.07 U6.35
  Bottom Layer w0.762: U6.35 J2.6
$1N694: length 7.7
  Bottom Layer w1.016: SW1.2 48.64,3.86 47.53,4.97 D3.1
$1N706: length 37.8
  Top Layer w1.016: CN1.1 37,4.78 37,8.76 D3.2
  Bottom Layer w0.762: P1.3 34.82,6.15 CN1.1
  Bottom Layer w1.016: DC1.4 13.52,15.93 19.69,15.93 29.46,6.15 P1.3
$1N761: length 89.5
  Top Layer w1.016: U1.1 15.42,29.82 15.26,29.66 3.83,29.66 3.79,29.62 3.52,29.62 C2.2 3.52,21.31 C1.1
  Bottom Layer w1.016: SW1.3 51.44,1.45 11.49,1.45 4.83,8.12 H1.4 H1.2 4.83,14.78 3.47,16.14 C1.1
$1N1576: length 22.2
  Top Layer w0.762: U1.2 22.11,34.12 L1.1 28.01,28.45 28.01,21.26
$1N1960: length 2.9
  Top Layer w0.762: R1.1 12.32,48.22 LED1.1
$1N2428: length 15
  Top Layer w0.762: USB1.3 73.75,13.72 73.39,13.36 73.39,13.15 72.58,12.34 68.46,12.34 66.84,13.97 62.05,13.97 R3.2
$1N2433: length 9
  Top Layer w0.762: R2.2 70.45,15.28 USB1.2
$1N2459: length 19.3
  Top Layer w0.254: U2.7 79.63,31.61 v1(79.12,31.61) ; X1.2 75.56,35.67 v1(75.82,35.42)
  Top Layer w0.762: X1.2 75.06,36.78 74.18,37.66 74.18,45.51 75.2,46.53 C6.1
  Bottom Layer w0.254: v1(75.82,35.42) 75.82,34.91 v1(79.12,31.61)
$1N2861: length 17.4
  Top Layer w0.762: C7.2 77.34,49.52 77.34,49.31 80.01,46.65 80.01,43.23 78.64,41.86 78.64,35.81 79.6,34.85 U2.4
$1N2986: length 2.9
  Top Layer w0.762: LED2.1 79.66,24.59 R4.1
$1N3014: length 21.8
  Top Layer w0.254: U2.8 80.88,30.46 81.12,30.46 81.83,31.17 81.83,33.45 81.12,34.16 78.03,34.16 77.98,34.21
  Top Layer w0.381: C5.1 77.96,40.59 77.96,35.53 77.98,35.52 77.98,34.21 75.66,31.9 75.56,31.9
$1N3837: length 3.4
  Top Layer w0.762: LED3.1 R5.1
$1N4420: length 19.9
  Top Layer w0.762: 5.48,67.61 C11.1 5.48,78.67 5.43,78.72 5.43,81.54 R6.1 ; 5.48,67.61 7.54,67.61 ; 5.48,67.61 1.6,67.61
$1N4944: length 20.9
  Top Layer w0.762: 15.35,67.87 17.24,67.87 17.25,67.86 ; 15.35,67.87 15.41,67.92 15.41,74.29 C15.1 15.35,78.31 C16.1 15.21,78.62 15.21,78.71 12.95,80.97 12.95,81.64 R7.1 ; 15.35,67.87 15.11,67.87 15.12,67.86 11.31,67.86
$1N5554: length 10.7
  Bottom Layer w0.762: J1.1 U6.1
$1N5558: length 10.7
  Bottom Layer w0.762: J1.2 U6.2
$1N5563: length 10.7
  Bottom Layer w0.762: J1.3 U6.3
$1N5568: length 10.7
  Bottom Layer w0.762: J1.4 U6.4
$1N5611: length 10.7
  Bottom Layer w0.762: J1.12 U6.12
$1N5616: length 10.7
  Bottom Layer w0.762: J1.13 U6.13
$1N5639: length 10.7
  Bottom Layer w0.762: J1.17 U6.17
$1N5662: length 10
  Bottom Layer w0.762: J2.20 U6.21
$1N5667: length 10
  Bottom Layer w0.762: J2.19 U6.22
$1N5672: length 10
  Bottom Layer w0.762: J2.18 U6.23
$1N5677: length 10
  Bottom Layer w0.762: J2.17 U6.24
$1N5787: length 10
  Bottom Layer w0.762: J2.4 U6.37
$1N6236: length 4.3
  Top Layer w0.762: R8.2 47.54,22.81 LED6.2
$1N6373: length 3.8
  Top Layer w0.762: LED7.2 55.48,22.78 R9.2
$1N6456: length 4
  Top Layer w0.762: R10.2 62.93,22.66 LED8.2
$1N6539: length 3.8
  Top Layer w0.762: R11.2 70.47,22.78 LED9.2
$1N7955: length 10
  Top Layer w0.762: 23.13,14.53 23.13,14.53 23.12,14.53 ; 23.13,14.53 23.12,14.53 ; 23.13,14.53 Q1.2 ; 23.12,14.53 22.25,13.66 22.25,13.65 R17.1 ; 23.12,14.53 22.57,14.53 22.56,14.53 22.56,14.53 22.24,14.85 22.24,14.86 R16.1
$1N8079: length 22.4
  Top Layer w0.762: H5.2 43.81,15.04 43.06,15.79 40.65,15.79 39.08,17.36 26.58,17.36 25.23,16.01 23.6,16.01 R16.2
$1N8113: length 11.3
  Bottom Layer w0.762: Q1.3 28.61,15.8 29.45,14.96 29.45,14.89 29.97,14.37 37.17,14.37 37.93,15.14 BUZZER2.2
$1N10922: length 33
  Top Layer w0.508: R18.1 87.68,81.78 87.68,81.78 86.1,83.36
  Top Layer w0.762: C19.1 75.84,82.35 79.07,82.35 U7.4 ; U7.4 U7.2 ; U7.4 80.09,79.86 81.79,78.16 84.33,78.16 84.58,77.9 84.58,75.9 84.04,75.36 81.86,75.36 81.14,74.64 81.14,74.5 C20.1
$1N10923: length 20.4
  Top Layer w0.762: 92.07,79.24 92.07,81.71 90.41,83.38 R19.1 89.15,83.37 87.93,84.59 87.93,84.73 87.88,84.78 87.88,88.57 89.28,89.97 LED10.2 ; 92.07,79.24 90.87,79.24 89.92,78.28 89.31,78.28 R18.2 ; 92.07,79.24 95.19,79.24 H6.7
$1N11076: length 6.6
  Top Layer w0.762: H6.3 94.12,85.38 R19.2
$1N14185: length 3.1
  Top Layer w0.254: 44.7,95.06 R21.2
  Top Layer w0.762: H8.4 44.7,95.06
$1N14299: length 10.5
  Top Layer w0.762: R21.1 42.67,95.03 42.67,93.99 42.69,93.97 42.69,91.38 H9.2 42.67,91.58 41.35,92.9 39.82,92.9 38.5,94.22 38.5,94.23 R20.1
$1N14888: length 3.6
  Bottom Layer w0.254: H15.2 86.49,60.38 H14.2
$1N15101: length 3.4
  Top Layer w0.762: R23.2 66.03,94.68 H16.4
$1N15107: length 9.2
  Top Layer w0.254: 64.01,94.22 64.01,94.65
  Top Layer w0.381: R22.1 60.01,93.65 63.44,93.65 64.01,94.22 H17.2
$1N15321: length 3.7
  Top Layer w0.762: H18.4 87.74,97.92 R25.2
$1N15327: length 9.5
  Top Layer w0.762: 85.72,91.11 85.74,91.13 R25.1 85.34,94.41 84.2,93.27 81.85,93.27 81.76,93.36 81.75,93.36 81.44,93.67 81.44,93.68 R24.1

## Copper pours and planes (outline as drawn; the poured copper is in the pictures)
GND on Top Layer: -3.68,103.17 104.27,103.17 104.27,-4.65 -3.68,-4.65
GND on Bottom Layer: -8.89,107.62 111.63,107.62 111.63,-10.74 -8.89,-10.74

## Text on the board
Bottom Silkscreen Layer: 作者：轻歌
Top Silkscreen Layer: VCC-MCU | VCC-5V | 7.4-12V | GND | 5V GND | 3.3V GND | VCC | 蜂鸣器 | VCC GND | VCC GND       AO | LED灯 | OFF | ON | 5V供电指示灯 | 串口收发数据指示灯 | 按键 | ESP8266 | 3.3V MCU | 3.3V EX | TX RX GND VCC | HC-05 蓝牙 | 0.96寸OLED屏 | GND VCC SCL SDA | 舵机模块 | 串口1-USB开关 | DHT11
